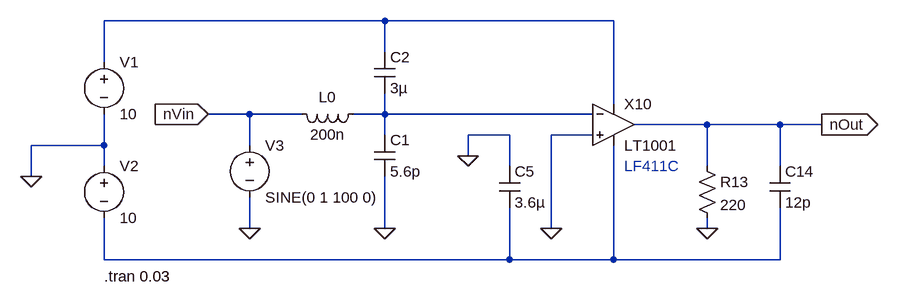
[diagram p0: schematic 71669199.asc]
71669199.asc, the LTspice schematic file:
Version 4
SHEET 1 880 680
WIRE 64 -80 -368 -80
WIRE 416 -80 64 -80
WIRE 64 -32 64 -80
WIRE -368 -16 -368 -80
WIRE 416 48 416 -80
WIRE -144 64 -208 64
WIRE -64 64 -144 64
WIRE 64 64 64 32
WIRE 64 64 16 64
WIRE 384 64 64 64
WIRE 560 80 448 80
WIRE 672 80 560 80
WIRE 736 80 672 80
WIRE 64 96 64 64
WIRE 256 96 192 96
WIRE 384 96 320 96
WIRE -368 112 -368 64
WIRE -368 112 -480 112
WIRE -144 112 -144 64
WIRE 192 128 192 96
WIRE -368 144 -368 112
WIRE 256 144 256 96
WIRE 560 144 560 80
WIRE 672 144 672 80
WIRE -480 160 -480 112
WIRE -144 240 -144 192
WIRE 64 240 64 160
WIRE 320 240 320 96
WIRE 560 240 560 224
WIRE -368 288 -368 224
WIRE 256 288 256 208
WIRE 256 288 -368 288
WIRE 416 288 416 112
WIRE 416 288 256 288
WIRE 672 288 672 208
WIRE 672 288 416 288
FLAG -480 160 0
FLAG -208 64 nVin
IOPIN -208 64 In
FLAG 64 240 0
FLAG 320 240 0
FLAG 560 240 0
FLAG 736 80 nOut
IOPIN 736 80 Out
FLAG 192 128 0
FLAG -144 240 0
SYMBOL ind 32 48 R90
WINDOW 0 5 56 VBottom 2
WINDOW 3 32 56 VTop 2
SYMATTR InstName L0
SYMATTR Value 200n
SYMBOL cap 48 96 R0
SYMATTR InstName C1
SYMATTR Value 5.6p
SYMBOL cap 48 -32 R0
SYMATTR InstName C2
SYMATTR Value 3µ
SYMBOL voltage -368 -32 R0
WINDOW 123 0 0 Left 0
WINDOW 39 0 0 Left 0
SYMATTR InstName V1
SYMATTR Value 10
SYMBOL voltage -368 128 R0
WINDOW 123 0 0 Left 0
WINDOW 39 0 0 Left 0
SYMATTR InstName V2
SYMATTR Value 10
SYMBOL Opamps\\LT1001 416 16 R0
SYMATTR InstName X10
SYMBOL cap 240 144 R0
SYMATTR InstName C5
SYMATTR Value 3.6µ
SYMBOL res 544 128 R0
SYMATTR InstName R13
SYMATTR Value 220
SYMBOL cap 656 144 R0
SYMATTR InstName C14
SYMATTR Value 12p
SYMBOL voltage -144 96 R0
WINDOW 123 0 0 Left 0
WINDOW 39 0 0 Left 0
SYMATTR InstName V3
SYMATTR Value SINE(0 1 100 0)
TEXT -368 314 Left 2 !.tran 0.03
TEXT 432 144 Left 2 ;LF411C

The netlist it stands for:
* 71669199.asc
L0 N002 nVin 200n
C1 N002 0 5.6p
C2 N001 N002 3µ
V1 N001 0 10
V2 0 N003 10
XX10 0 N002 N001 N003 nOut LT1001  ; pins In+ In- V+ V- OUT
C5 0 N003 3.6µ
R13 nOut 0 220
C14 nOut N003 12p
V3 nVin 0 SINE(0 1 100 0)
.tran 0.03
* LF411C
.lib LTC.lib
.backanno
.end